# EAGLE design Linear_PowerSupply (EAGLE 9.6.2)
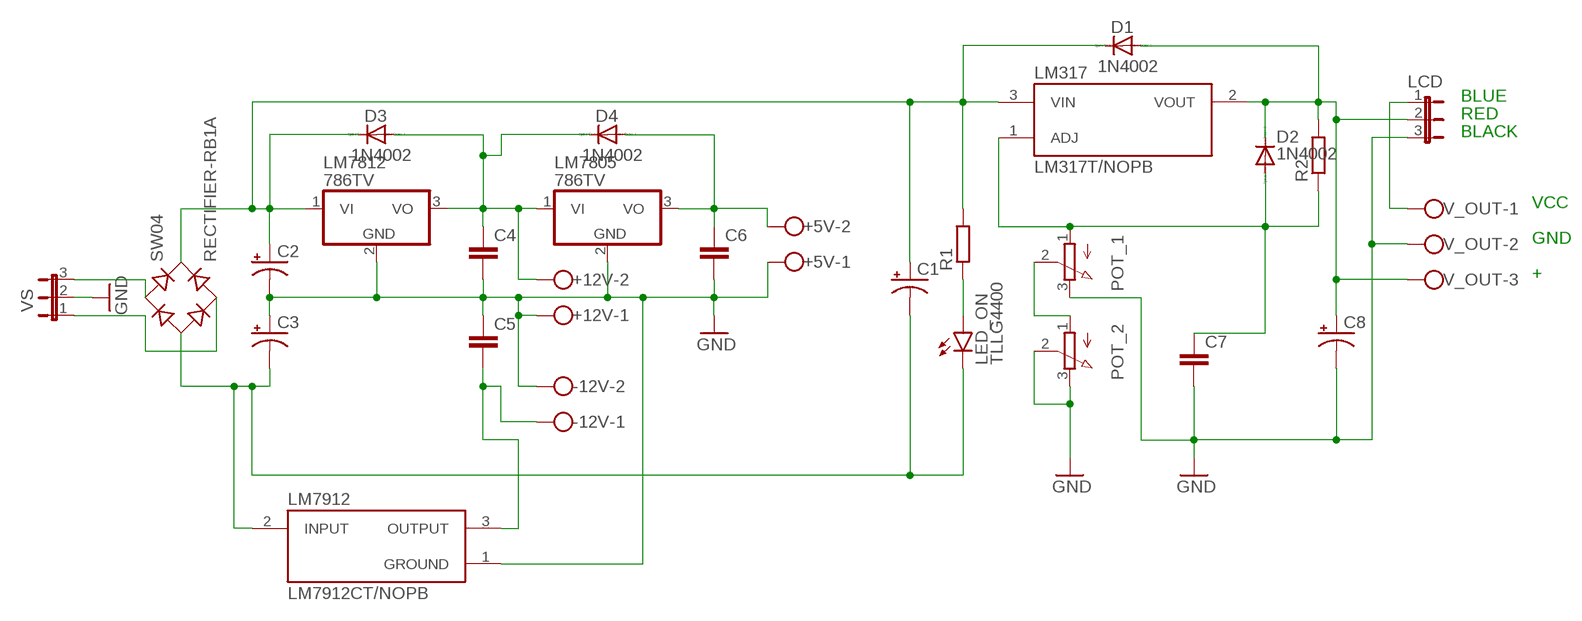
[diagram p0: schematic, sheet 1]

## Parts
+5V  W237-102  [W237-102]
+12V  W237-102  [W237-102]
-12V  W237-102  [W237-102]
C1  CPOL-USE5-13  [E5-13]
C2  CPOL-USE3.5-8  [E3,5-8]
C3  CPOL-USE3.5-8  [E3,5-8]
C4  C-EU025-024X044  [C025-024X044]
C5  C-EU025-024X044  [C025-024X044]
C6  C-EU025-024X044  [C025-024X044]
C7  C-EU025-024X044  [C025-024X044]
C8  CPOL-USE3.5-8  [E3,5-8]
D1  1N4002  1N4004  [DO41-10]
D2  1N4002  1N4004  [DO41-10]
D3  1N4002  1N4004  [DO41-10]
D4  1N4002  1N4004  [DO41-10]
LCD  JP2E  [JP2]
LED_ON  TLLG4400  [LED3MM]
LM317  LM317T/NOPB  [LM317T/NOPB_TO254P1054X470X1955-3]
LM7805  786TV  [TO220V]
LM7812  786TV  [TO220V]
LM7912  LM7912CT/NOPB  [TO254P1054X470X1955-3]
POT_1  3RP/1610N  [3RP/1610N]
POT_2  3RP/1610N  [3RP/1610N]
R1  R-EU_0207/10  [0207/10]
R2  R-EU_0207/10  [0207/10]
SW04  RECTIFIER-RB1A  [RB1A]
V_OUT  W237-103  [W237-103]
VS  JP2E  [JP2]

## Nets
GND: +5V.1 +12V.1 -12V.2 C2.- C3.+ C4.2 C5.1 C6.2 C7.2 C8.- LCD.3 LM7805.2(GND) LM7812.2(GND) LM7912.1(GROUND) POT_1.3(E) POT_2.2(S) POT_2.3(E) V_OUT.2 VS.2
N$1: LED_ON.A R1.1
N$2: C7.1 D2.A LM317.1(ADJ) POT_1.1(A) R2.1
N$3: LCD.1 V_OUT.1
N$4: C8.+ D1.A D2.C LCD.2 LM317.2(VOUT) R2.2 V_OUT.3
N$6: C1.+ C2.+ D1.C D3.C LM317.3(VIN) LM7812.1(VI) R1.2 SW04.+
N$7: C1.- C3.- LED_ON.K(C) LM7912.2(INPUT) SW04.-
N$8: POT_1.2(S) POT_2.1(A)
N$10: -12V.1 C5.2 LM7912.3(OUTPUT)
N$11: +12V.2 C4.1 D3.A D4.C LM7805.1(VI) LM7812.3(VO)
N$13: +5V.2 C6.1 D4.A LM7805.3(VO)
VAC+: SW04.AC1 VS.3
VAC-: SW04.AC2 VS.1

## Notes on the sheet
- BLUE
- RED
- BLACK
- VCC
- GND
- +

## Library data of the parts
+5V +12V -12V = con-wago-500:W237-102: WAGO SCREW CLAMP; MPN: 237-102; OC_FARNELL: unknown; OC_NEWARK: 70K9898
C1-C3 C8 = rcl:CPOL-US: POLARIZED CAPACITOR, American symbol; SPICEPREFIX: C
C4-C7 = rcl:C-EU: CAPACITOR, European symbol; SPICEPREFIX: C
D1-D4 = diode:1N4004: DIODE general purpose rectifier, 1 A
LCD VS = jumper:JP2E: JUMPER
LED_ON = led:TLLG4400: Low Current (2mA) LED 3 mm Tinted Diffused Package color GREEN Source: Data sheet <http://www.farnell.com/datasheets/391098.pdf>; MF: VISHAY SEMICONDUCTOR; OC_FARNELL: 1612435
LM317 = SnapEDA-Library:LM317T/NOPB; MANUFACTURER: Texas Instruments; MAXIMUM_PACKAGE_HEIGHT: 19.55mm; PARTREV: Q; SNAPEDA_PACKAGE_ID: 102750; STANDARD: IPC-7351B
LM7805 LM7812 = linear:78*: Positive VOLTAGE REGULATOR Source: http://cache.national.com/ds/LM/LM78L05.pdf http://www.fairchildsemi.com/ds/LM/LM7805.pdf
LM7912 = SnapEDA-Library:LM7912CT/NOPB; MANUFACTURER: Texas Instruments; MAXIMUM_PACKAGE_HEIGHT: 19.55mm; PARTREV: C; SNAPEDA_PACKAGE_ID: 102750; STANDARD: IPC-7351B
POT_1 POT_2 = pot:3RP/1610N: 16mm Potentiometer one level Source: http://www.alphapotentiometers.net/html/16mm_pot_2.html
R1 R2 = resistor:R-EU_: RESISTOR, European symbol
SW04 = rectifier:RECTIFIER-: Rectifier
V_OUT = con-wago-500:W237-103: WAGO SCREW CLAMP; MPN: 237-103; OC_FARNELL: unknown; OC_NEWARK: 18M7116

## Board
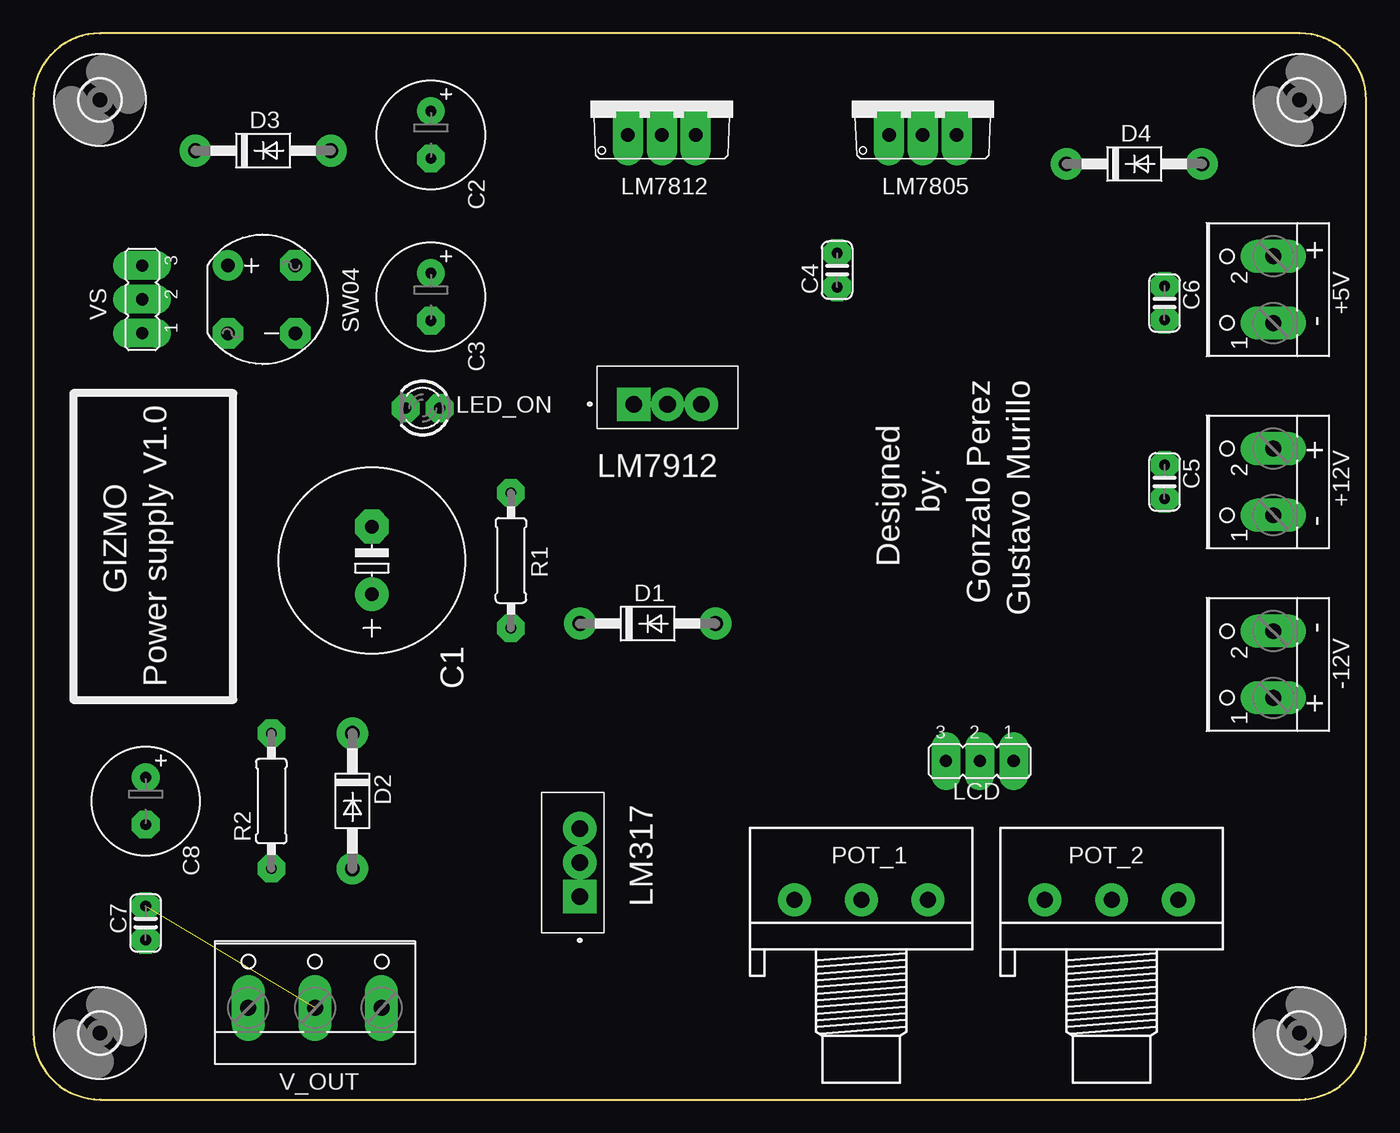
[diagram p1: board, top side]
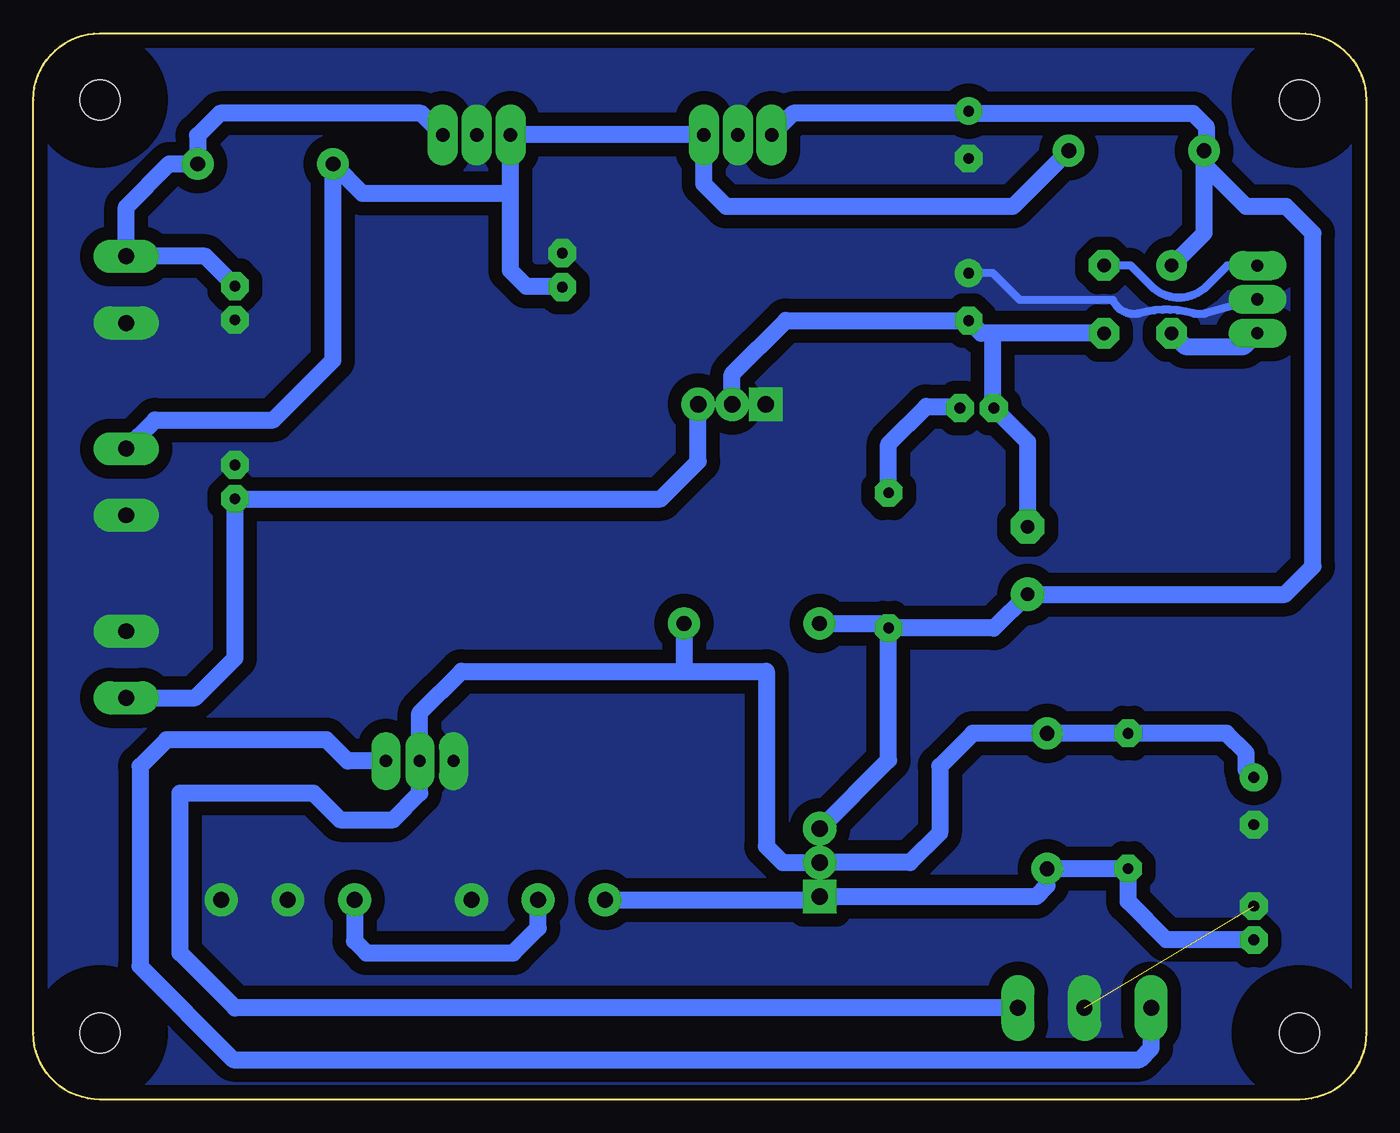
[diagram p2: board, bottom side, seen from below]

Size 100 x 80 mm. Coordinates in mm from the lower left corner, seen from the top.
Outline: 0,75 0,5 arc90 5,0 95,0 arc90 100,5 100,75 arc90 95,80 5,80 arc90 0,75
Copper layers (1*16): Top 0.035mm / dielectric 1.5mm / Bottom 0.035mm
Design rules "default *": minimum track width 6mil, minimum drill 0.35mm, track to track 6mil, track to pad 6mil, pad to pad 6mil, via to via 6mil, smd to smd 6mil, copper to edge 40mil, drill to drill 6mil, minimum pad ring 25mil, minimum via ring 8mil, stop-mask expansion 4mil, vias tented up to drill 0mil, thermal gap 0mil

### Footprints (pad centres in the part's own frame; a part is rotated, then mirrored left to right if it is on the bottom)
W237-102 = drill 1.194 long: 1 -2.5,-1.27; 2 2.5,-1.27
E5-13 = drill 1.016 pad 2.54: + -2.54,0 | drill 1.016 pad 2.54 octagon: - 2.54,0
E3,5-8 = drill 0.813 pad 1.6: + -1.778,0 | drill 0.813 pad 1.6 octagon: - 1.778,0
C025-024X044 = drill 0.813 octagon: 1 -1.27,0; 2 1.27,0
DO41-10 = drill 1.118: A 5.08,0; C -5.08,0
JP2 = drill 0.914 long: 1 -2.54,0; 2 0,0; 3 2.54,0
LED3MM = drill 0.813 octagon: A -1.27,0; K 1.27,0
LM317T/NOPB_TO254P1054X470X1955-3 = drill 1.24 square: 1 -2.54,0 | drill 1.24: 2 0,0; 3 2.54,0
TO220V = drill 1.016 long: 1 -2.54,-2.54; 2 0,-2.54; 3 2.54,-2.54
TO254P1054X470X1955-3 = drill 1.24 square: 1 -2.54,0 | drill 1.24: 2 0,0; 3 2.54,0
3RP/1610N = drill 1.2 pad 2.184: 1 -5,0; 2 0,0; 3 5,0
0207/10 = drill 0.813 octagon: 1 -5.08,0; 2 5.08,0
RB1A = drill 1.016: + -2.54,2.54 | drill 1.016 octagon: - 2.54,-2.54; AC1 2.54,2.54; AC2 -2.54,-2.54
3,0 = hole 3: 0,0
W237-103 = drill 1.194 long: 1 -5,-1.29; 2 0,-1.29; 3 5,-1.29

### Placement (x,y rotation side)
+5V  91.76,60.77 90 top
+12V  91.76,46.34 90 top
-12V  91.76,32.64 90 top
C1  25.4,40.45 90 top
C2  29.83,72.39 270 top
C3  29.83,60.23 270 top
C4  60.31,62.23 90 top
C5  84.87,46.34 270 top
C6  84.87,59.77 270 top
C7  8.43,13.24 90 top
C8  8.43,22.4 270 top
D1  46.09,35.71 0 top
D2  23.94,22.4 270 top
D3  17.24,71.2 0 top
D4  82.6,70.2 0 top
LCD  71.01,25.4 180 top
LED_ON  29.21,51.88 180 top
LM317  40.99,17.78 90 top
LM7805  66.74,74.93 0 top
LM7812  47.15,74.93 0 top
LM7912  47.58,52.18 0 top
POT_1  62.12,14.97 0 top
POT_2  80.9,14.97 0 top
R1  35.83,40.45 270 top
R2  17.86,22.4 90 top
SW04  17.13,60.04 0 top
U$1  [3,0]  5,75 0 top
U$2  [3,0]  5,5 0 top
U$3  [3,0]  95,75 0 top
U$4  [3,0]  95,5 0 top
V_OUT  21.13,8.16 0 top
VS  8.16,60.04 90 top

### Tracks (layer width: path | path; a pad name or v marks a point on that pad's centre or on a via)
GND  (1 unrouted)
  Bottom 0.61: VS.2 12,59 arc30 13,59 arc-30 17,59 arc83 19,60 26,60 28.01,62.01 C3.+
  pour Bottom (isolate 1.016): 96,0 5,0 arc-90 0,5 0,75 arc-90 5,80 96,80 arc-90 101,75 101,5 arc-90
N$1
  Bottom 1.27: R1.1 35.83,49.17 33,52 30.6,52 LED_ON.A
N$2
  Bottom 1.27: POT_1.1 41.26,14.97 LM317.1 24.76,15.24 23.94,16.06 D2.A R2.1 17.86,14.86 15,12 8.46,12 C7.1
N$3
  Bottom 1.27: LCD.1 76.4,25.4 78,27 90,27 92,25 92,10 85,3 17,3 16.13,3.87 V_OUT.1
N$4
  Bottom 1.27: 51,32.12 67.88,32.12 71.01,28.99 LCD.2 71.01,22.99 73,21 77,21 79,23 89,23 89,11 84.87,6.87 V_OUT.3 | 51,32.12 45,32.12 45,19 43.78,17.78 LM317.2 34.22,17.78 32,20 32,25 29.52,27.48 D2.C R2.2 10.48,27.48 9,26 9,24.75 C8.+ | D1.A 51.17,32.29 51,32.12
N$6
  Bottom 1.27: R1.2 27.94,35.37 C1.+ 6.09,37.91 4,40 4,65 6,67 9,67 12.16,70.16 | 12.16,70.16 D3.C 12,71.36 12,73 13,74 29.66,74 C2.+ 30,74 43,74 LM7812.1 | SW04.+ 12.16,65.01 12.16,70.16 | LM317.3 35.83,25.48 R1.2 | D1.C 36.17,35.71 R1.2
N$7
  Bottom 1.27: SW04.- 28,57.5 | 28,57.5 28.88,57.5 C3.- 43.55,58.45 47.58,54.42 LM7912.2 | 28,57.5 28,51.94 LED_ON.K 25.4,49.34 C1.-
N$8
  Bottom 1.27: POT_2.1 75.9,11.9 75,11 64,11 62.12,12.88 POT_1.2
N$10
  Bottom 1.27: LM7912.3 50.12,47.88 52.93,45.07 C5.2 84.87,33.13 87.86,30.14 -12V.1
N$11
  Bottom 1.27: D3.A 26.52,67 48,67 49.69,68.69 LM7812.3 LM7805.1 64.2,68 | C4.1 60.35,61 63,61 64.2,62.2 64.2,68 | 64.2,68 75.32,68 D4.C 77.52,55.48 82,51 90.87,51 +12V.2
N$13
  Bottom 1.27: LM7805.3 70.89,74 86,74 87.68,72.32 D4.A 89.8,70.2 93.03,66.97 +5V.2 87.1,63.27 C6.1
VAC+
  Bottom 0.61: VS.3 10.42,62.58 12,61 arc90 16.09,61 17.67,62.58 SW04.AC1
VAC-
  Bottom 1.27: VS.1 9.16,56.5 13.59,56.5 SW04.AC2

### Text on the board
tPlace: + | - | Gonzalo Perez | Gustavo Murillo | + | by: | - | Designed | GIZMO | - | Power supply V1.0 | +